# EAGLE design Arm controller (EAGLE 9.2.0)
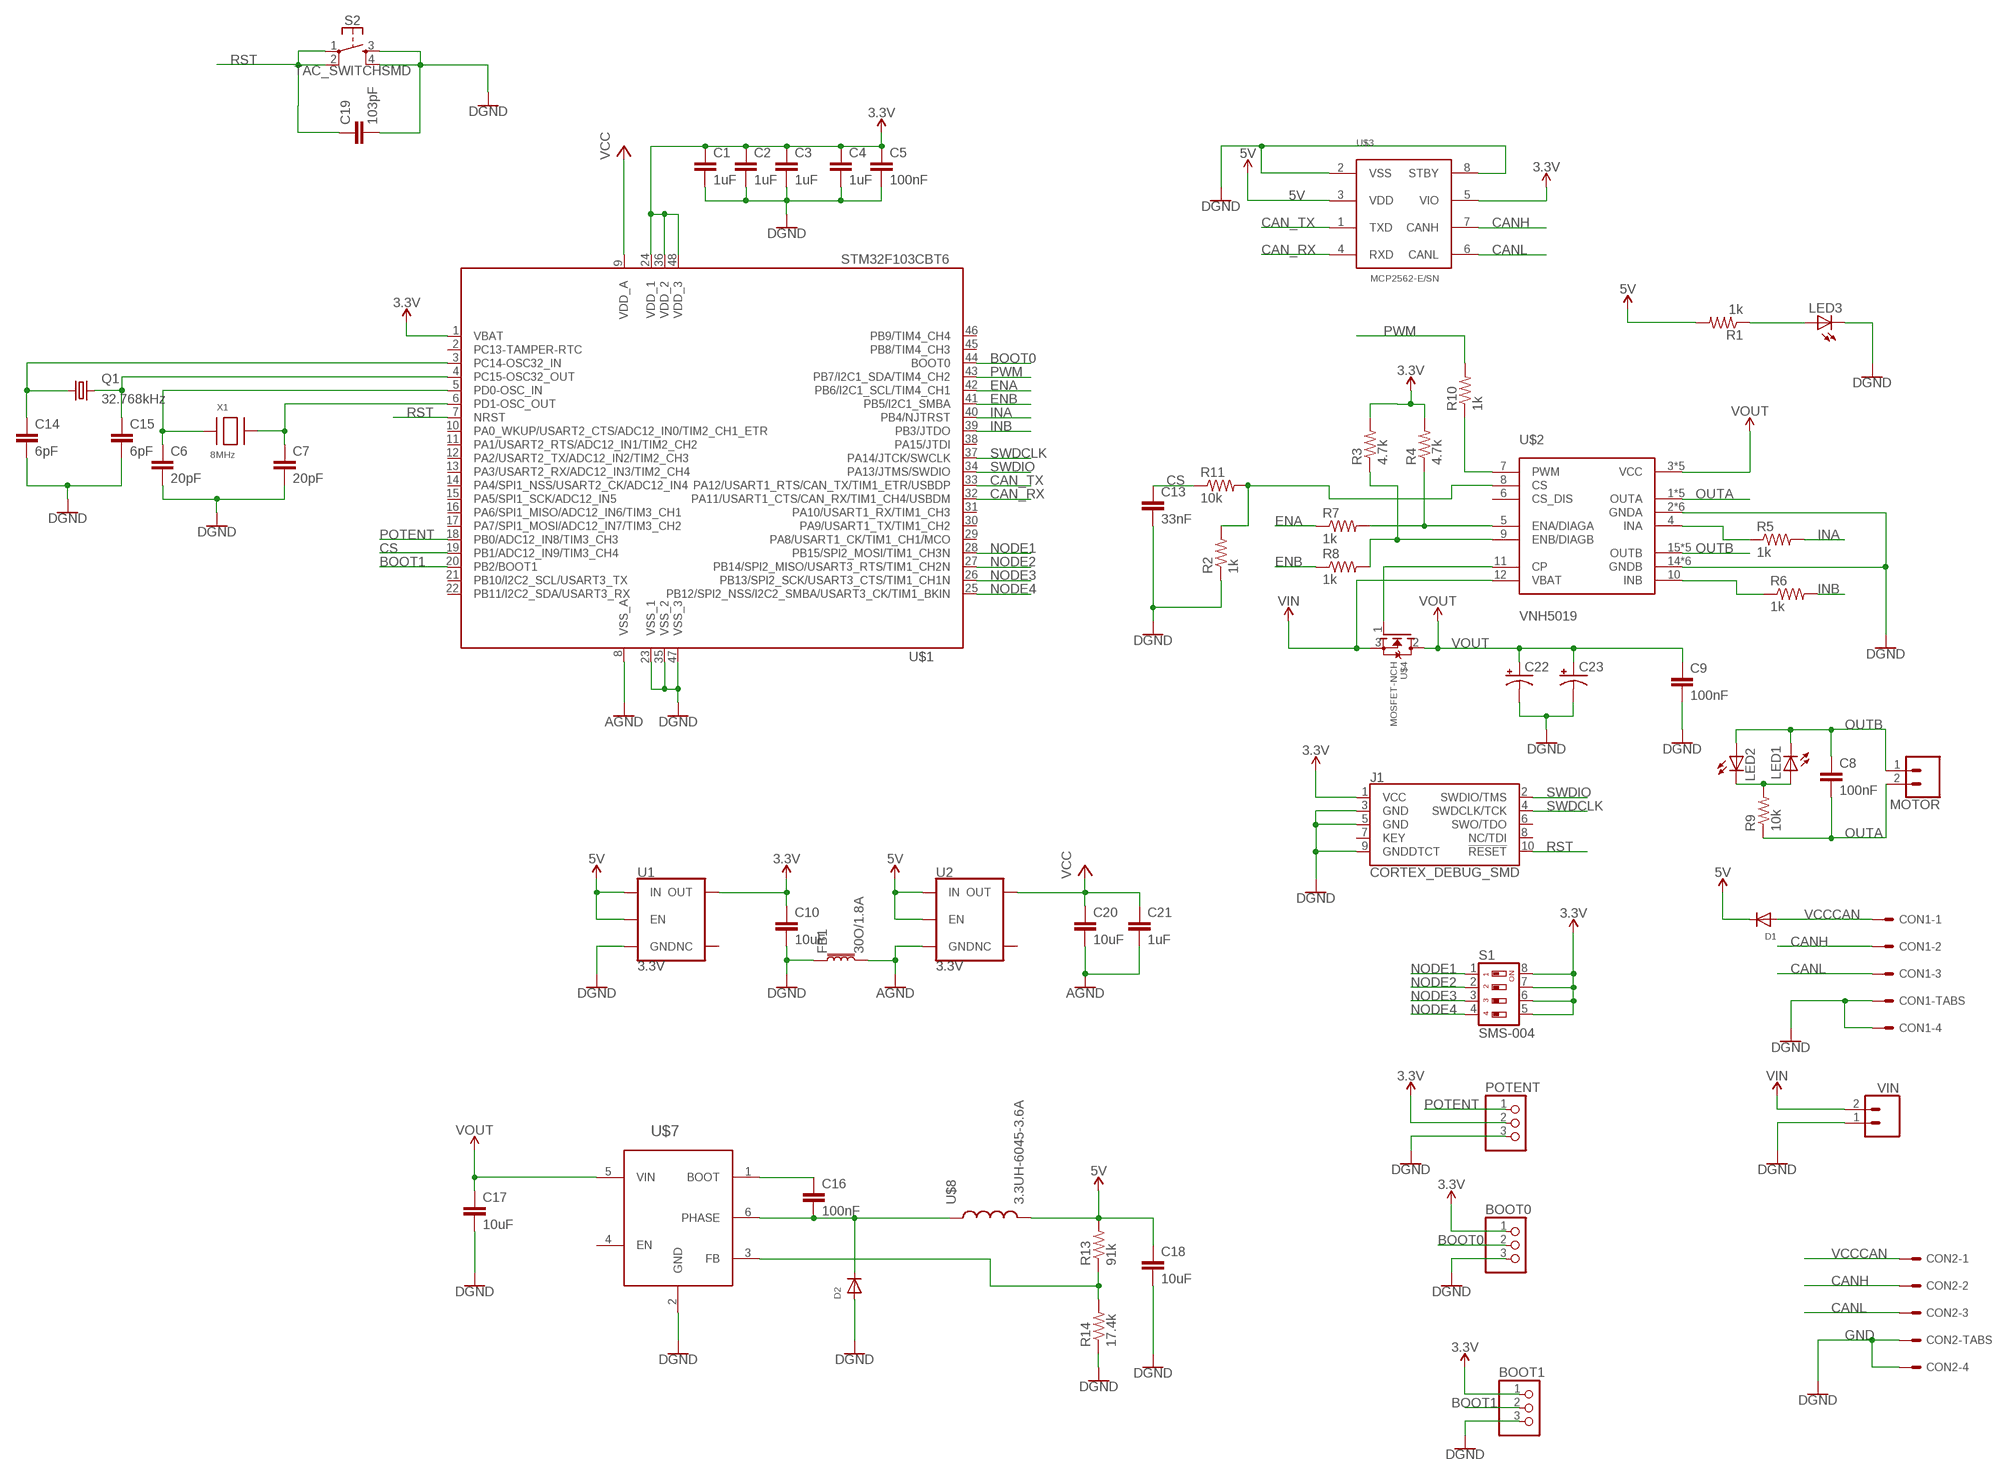
[diagram p0: schematic, sheet 1]

## Parts
BOOT0  PINHD-1X3  [1X03]
BOOT1  PINHD-1X3  [1X03]
C1  1uF  C-EUC0805  [C0805]
C2  1uF  C-EUC0805  [C0805]
C3  1uF  C-EUC0805  [C0805]
C4  1uF  C-EUC0805  [C0805]
C5  100nF  C-EUC0805  [C0805]
C6  20pF  C-EUC0805  [C0805]
C7  20pF  C-EUC0805  [C0805]
C8  100nF  C-EUC1206  [C1206]
C9  100nF  C-EUC0805  [C0805]
C10  10uF  C-EUC1206  [C1206]
C13  33nF  C-EUC0805  [C0805]
C14  6pF  C-EUC0805  [C0805]
C15  6pF  C-EUC0805  [C0805]
C16  100nF  C-EUC0805  [C0805]
C17  10uF  C-EUC1206  [C1206]
C18  10uF  C-EUC1206  [C1206]
C19  103pF  C-EUC0805  [C0805]
C20  10uF  C-EUC1206  [C1206]
C21  1uF  C-EUC0805  [C0805]
C22  CPOL-USCT7343  [CT7343]
C23  CPOL-USCT7343  [CT7343]
CON1  SM04B-GHS-TB  [SM04B-GHS-TB]
CON2  SM04B-GHS-TB  [SM04B-GHS-TB]
D1  DIODESOD-123  [SOD-123]
D2  DIODESOD-123  [SOD-123]
FB1  30O/1.8A  FERRITE_BEAD-0603  [0603]
J1  CORTEX_DEBUG_SMD  [SAMTECH_FTSH-105-01]
LED1  LEDCHIPLED_0805  [CHIPLED_0805]
LED2  LEDCHIPLED_0805  [CHIPLED_0805]
LED3  LEDCHIPLED_0805  [CHIPLED_0805]
MOTOR  CONN_025MM  [SCREWTERMINAL-5MM-2]
POTENT  PINHD-1X3  [1X03]
Q1  32.768kHz  KX-327  [3.2X1.5]
R1  1k  R-US_R0805  [R0805]
R2  1k  R-US_R0805  [R0805]
R3  4.7k  R-US_R0805  [R0805]
R4  4.7k  R-US_R0805  [R0805]
R5  1k  R-US_R0805  [R0805]
R6  1k  R-US_R0805  [R0805]
R7  1k  R-US_R0805  [R0805]
R8  1k  R-US_R0805  [R0805]
R9  10k  R-US_R0805  [R0805]
R10  1k  R-US_R0805  [R0805]
R11  10k  R-US_R0805  [R0805]
R13  91k  R-US_R0805  [R0805]
R14  17.4k  R-US_R0805  [R0805]
S1  SMS-004  [SMS-004]
S2  TAC_SWITCHSMD  MOMENTARY-SWITCH-SPST-2-SMD-5.2MM  [TACTILE_SWITCH_SMD_5.2MM]
U1  3.3V  V_REG_AP2112K-3.3V  [SOT23-5]
U2  3.3V  V_REG_AP2112K-3.3V  [SOT23-5]
U$1  STM32F103CBT6  [STM32_LQFP48]
U$2  VNH5019  [MULTIPOWERSO-30]
U$3  MCP2562-E/SN  [SOIC8]
U$4  MOSFET-NCH  [TO252-3]
U$7  RT6200  [TSOT23-6]
U$8  3.3UH-6045-3.6A  [INDC6161X450]
VIN  CONN_025MM  [SCREWTERMINAL-5MM-2]
X1  8MHz  XTALNX5032  [NX5032]

## Nets
1: R4.1 R7.2 U$2.5(ENA/DIAGA)
2: R3.1 R8.2 U$2.9(ENB/DIAGB)
3.3V: BOOT0.1 BOOT1.1 C1.1 C2.1 C3.1 C4.1 C5.1 C10.1 J1.1(VCC) POTENT.2 R3.2 R4.2 S1.5 S1.6 S1.7 S1.8 U1.5(OUT) U$1.1(VBAT) U$1.24(VDD_1) U$1.36(VDD_2) U$1.48(VDD_3) U$3.5(VIO)
5V: C18.1 D1.C R1.2 R13.2 U1.1(IN) U1.3(EN) U2.1(IN) U2.3(EN) U$3.3(VDD) U$8.2
AGND: C20.2 C21.2 FB1.2 U2.2(GND) U$1.8(VSS_A)
BOOT0: BOOT0.2 U$1.44(BOOT0)
BOOT1: BOOT1.2 U$1.20(PB2/BOOT1)
CAN_RX: U$1.32(PA11/USART1_CTS/CAN_RX/TIM1_CH4/USBDM) U$3.4(RXD)
CAN_TX: U$1.33(PA12/USART1_RTS/CAN_TX/TIM1_ETR/USBDP) U$3.1(TXD)
CANH: CON1.P$2 CON2.P$2 U$3.7(CANH)
CANL: CON1.P$3 CON2.P$3 U$3.6(CANL)
CS: C13.1 R11.1 U$1.19(PB1/ADC12_IN9/TIM3_CH4)
ENA: R7.1 U$1.42(PB6/I2C1_SCL/TIM4_CH1)
ENB: R8.1 U$1.41(PB5/I2C1_SMBA)
GND: BOOT0.3 BOOT1.3 C1.2 C2.2 C3.2 C4.2 C5.2 C6.2 C7.2 C9.2 C10.2 C13.2 C14.2 C15.2 C17.2 C18.2 C19.2 C22.- C23.- CON1.P$4 CON1.P$5 CON1.P$6 CON2.P$4 CON2.P$5 CON2.P$6 D2.A FB1.1 J1.3(GND) J1.5(GND) J1.9(GNDDTCT) LED3.C POTENT.3 R2.1 R14.1 S2.3 S2.4 U1.2(GND) U$1.23(VSS_1) U$1.35(VSS_2) U$1.47(VSS_3) U$2.2(GNDA) U$2.14(GNDB) U$2.17(GNDB) U$2.18(GNDB) U$2.19(GNDB) U$2.20(GNDB) U$2.22(GNDA) U$2.24(GNDB) U$2.26(GNDA) U$2.27(GNDA) U$2.28(GNDA) U$2.29(GNDA) U$3.2(VSS) U$3.8(STBY) U$7.2(GND) VIN.1 ; supply symbol labelled DGND
INA: R5.2 U$1.40(PB4/NJTRST)
INB: R6.2 U$1.39(PB3/JTDO)
N$1: C6.1 U$1.5(PD0-OSC_IN) X1.P$1
N$2: C7.1 U$1.6(PD1-OSC_OUT) X1.P$2
N$3: LED1.A LED2.C R9.2
N$4: C14.1 Q1.1 U$1.3(PC14-OSC32_IN)
N$9: R5.1 U$2.4(INA)
N$10: R2.2 R11.2 U$2.8(CS)
N$12: R6.1 U$2.10(INB)
N$13: C15.1 Q1.2 U$1.4(PC15-OSC32_OUT)
N$14: U$2.11(CP) U$4.1(G)
N$16: C16.2 D2.C U$7.6(PHASE) U$8.1
N$18: R13.1 R14.2 U$7.3(FB)
N$20: R10.1 U$2.7(PWM)
N$21: C16.1 U$7.1(BOOT)
N$22: LED3.A R1.1
NODE1: S1.1 U$1.28(PB15/SPI2_MOSI/TIM1_CH3N)
NODE2: S1.2 U$1.27(PB14/SPI2_MISO/USART3_RTS/TIM1_CH2N)
NODE3: S1.3 U$1.26(PB13/SPI2_SCK/USART3_CTS/TIM1_CH1N)
NODE4: S1.4 U$1.25(PB12/SPI2_NSS/I2C2_SMBA/USART3_CK/TIM1_BKIN)
OUTA: C8.2 MOTOR.2 R9.1 U$2.1(OUTA) U$2.25(OUTA) U$2.30(OUTA) U$2.OUTA U$2.OUTA@1(OUTA)
OUTB: C8.1 LED1.C LED2.A MOTOR.1 U$2.15(OUTB) U$2.16(OUTB) U$2.21(OUTB) U$2.OUTB U$2.OUTB@1(OUTB)
POTENT: POTENT.1 U$1.18(PB0/ADC12_IN8/TIM3_CH3)
PWM: R10.2 U$1.43(PB7/I2C1_SDA/TIM4_CH2)
RST: C19.1 J1.10(!RESET) S2.1 S2.2 U$1.7(NRST)
SWDCLK: J1.4(SWDCLK/TCK) U$1.37(PA14/JTCK/SWCLK)
SWDIO: J1.2(SWDIO/TMS) U$1.34(PA13/JTMS/SWDIO)
VCC: C20.1 C21.1 U2.5(OUT) U$1.9(VDD_A)
VCCCAN: CON1.P$1 CON2.P$1 D1.A
VIN: U$2.12(VBAT) U$4.3(S) VIN.2
VOUT: C9.1 C17.1 C22.+ C23.+ U$2.3(VCC) U$2.13(VCC) U$2.23(VCC) U$2.VCC U$2.VCC@1(VCC) U$4.2(D) U$7.5(VIN)
Unconnected: J1.6(SWO/TDO) J1.7(KEY) J1.8(NC/TDI) U1.4(NC) U2.4(NC) U$1.2(PC13-TAMPER-RTC) U$1.10(PA0_WKUP/USART2_CTS/ADC12_IN0/TIM2_CH1_ETR) U$1.11(PA1/USART2_RTS/ADC12_IN1/TIM2_CH2) U$1.12(PA2/USART2_TX/ADC12_IN2/TIM2_CH3) U$1.13(PA3/USART2_RX/ADC12_IN3/TIM2_CH4) U$1.14(PA4/SPI1_NSS/USART2_CK/ADC12_IN4) U$1.15(PA5/SPI1_SCK/ADC12_IN5) U$1.16(PA6/SPI1_MISO/ADC12_IN6/TIM3_CH1) U$1.17(PA7/SPI1_MOSI/ADC12_IN7/TIM3_CH2) U$1.21(PB10/I2C2_SCL/USART3_TX) U$1.22(PB11/I2C2_SDA/USART3_RX) U$1.29(PA8/USART1_CK/TIM1_CH1/MCO) U$1.30(PA9/USART1_TX/TIM1_CH2) U$1.31(PA10/USART1_RX/TIM1_CH3) U$1.38(PA15/JTDI) U$1.45(PB8/TIM4_CH3) U$1.46(PB9/TIM4_CH4) U$2.6(CS_DIS) U$7.4(EN)

## Library data of the parts
BOOT0 BOOT1 POTENT = pinhead:PINHD-1X3: PIN HEADER
C1-C7 C9 C13-C15 C18 C19 C21 = rcl:C-EU: CAPACITOR, European symbol; SPICEPREFIX: C
C8 C10 C16 C17 C20 = resistor:C-EU: CAPACITOR, European symbol
C22 C23 = rcl:CPOL-US: POLARIZED CAPACITOR, American symbol; SPICEPREFIX: C
CON1 CON2 = SPEAR:SM04B-GHS-TB
D1 D2 = adafruit:DIODE: Diode SMADIODE - SMA Surface Mount Package 20V 1A Schottky Diode Digikey: 641-1014-6-ND DO-1N4148 - Through Hole Small Current Diode SOD-123 20V 1 A (.5mV Vf) Schottky Diode - Digikey: MBRX120TPMSCT-ND SOD-323 10V 570mA (.38mV Vf, 3ns) Schottky Diode - Digikey: ZLLS410CT-ND SOD-523 30V 30mA Schottky Diode (RB751S-40TE61) - Digikey: RB751S-40TE61CT-ND SOT23-R/W - SOT23 Package (R = Solder Paste/Reflow Ovens, W = Hand-Soldering) BAT54Film 40V 300mA - Digikey: 497-7162-1-ND
FB1 = SPEAR:FERRITE_BEAD: Ferrite Bead (blocks, cores, rings, chokes, etc.) Inductor with layers of ferrite used to suppress high frequencies. Often used to isolate high frequency noise. SparkFun Products: IOIO-OTG - V2.2 <https://www.sparkfun.com/products/13613> SparkFun SAMD21 Mini Breakout <https://www.sparkfun.com/products/13664> SparkFun 6 Degrees of Freedom Breakout - LSM6DS3 <https://www.sparkfun.com/products/13339> SparkFun SAMD21 Dev Breakout <https://www.sparkfun.com/products/13672>; PROD_ID: NDUC-13805
J1 = SparkFun-Connectors:CORTEX_DEBUG: Cortex Debug Connector - 10 pin Supports JTAG debug, Serial Wire debug, and Serial Wire Viewer. PTH and SMD connector options available. General Connector Information <http://infocenter.arm.com/help/topic/com.arm.doc.faqs/attached/13634/cortex_debug_connectors.pdf> Products: PTH Connector <http://www.digikey.com/product-detail/en/cnc-tech/3220-10-0100-00/1175-1627-ND/3883661> -via Digi-Key SparkFun PSoc <https://www.sparkfun.com/products/13229> SparkFun T <https://www.sparkfun.com/products/13810>
LED1-LED3 = led:LED: LED OSRAM: - CHIPLED LG R971, LG N971, LY N971, LG Q971, LY Q971, LO R971, LY R971 LH N974, LH R974 LS Q976, LO Q976, LY Q976 LO Q996 - Hyper CHIPLED LW Q18S LB Q993, LB Q99A, LB R99A - SideLED LS A670, LO A670, LY A670, LG A670, LP A670 LB A673, LV A673, LT A673, LW A673 LH A674 LY A675 LS A676, LA A676, LO A676, LY A676, LW A676 LS A679, LY A679, LG A679 - Hyper Micro SIDELED® LS Y876, LA Y876, LO Y876, LY Y876 LT Y87S - SmartLED LW L88C, LW L88S LB L89C, LB L89S, LG L890 LS L89K, LO L89K, LY L89K LS L896, LA L896, LO L896, LY L896 - TOPLED LS T670, LO T670, LY T670, LG T670, LP T670 LSG T670, LSP T670, LSY T670, LOP T670, LYG T670 LG T671, LOG T671, LSG T671 LB T673, LV T673, LT T673, LW T673 LH T674 LS T676, LA T676, LO T676, LY T676, LB T676, LH T676, LSB T676, LW T676 LB T67C, LV T67C, LT T67C, LS T67K, LO T67K, LY T67K, LW E67C LS E67B, LA E67B, LO E67B, LY E67B, LB E67C, LV E67C, LT E67C LW T67C LS T679, LY T679, LG T679 LS T770, LO T770, LY T770, LG T770, LP T770 LB T773, LV T773, LT T773, LW T773 LH T774 LS E675, LA E675, LY E675, LS T675 LS T776, LA T776, LO T776, LY T776, LB T776 LHGB T686 LT T68C, LB T68C - Hyper Mini TOPLED® LB M676 - Mini TOPLED Santana® LG M470 LS M47K, LO M47K, LY M47K Source: http://www.osram.convergy.de LUXEON: - LUMILED® LXK2-PW12-R00, LXK2-PW12-S00, LXK2-PW14-U00, LXK2-PW14-V00 LXK2-PM12-R00, LXK2-PM12-S00, LXK2-PM14-U00 LXK2-PE12-Q00, LXK2-PE12-R00, LXK2-PE12-S00, LXK2-PE14-T00, LXK2-PE14-U00 LXK2-PB12-K00, LXK2-PB12-L00, LXK2-PB12-M00, LXK2-PB14-N00, LXK2-PB14-P00, LXK2-PB14-Q00 LXK2-PR12-L00, LXK2-PR12-M00, LXK2-PR14-Q00, LXK2-PR14-R00 LXK2-PD12-Q00, LXK2-PD12-R00, LXK2-PD12-S00 LXK2-PH12-R00, LXK2-PH12-S00 LXK2-PL12-P00, LXK2-PL12-Q00, LXK2-PL12-R00 Source: www.luxeon.com KINGBRIGHT: KA-3528ASYC Source: www.kingbright.com
MOTOR VIN = SparkFun-Connectors:CONN_02: Multi connection point. Often used as Generic Header-pin footprint for 0.1 inch spaced/style header connections On any of the 0.1 inch spaced packages, you can populate with these: Break Away Headers - Straight <https://www.sparkfun.com/products/116> (PRT-00116) Break Away Male Headers - Right Angle <https://www.sparkfun.com/products/553> (PRT-00553) Female Headers <https://www.sparkfun.com/products/115> (PRT-00115) Break Away Headers - Machine Pin <https://www.sparkfun.com/products/117> (PRT-00117) Break Away Female Headers - Swiss Machine Pin <https://www.sparkfun.com/products/743> (PRT-00743) For SCREWTERMINALS and SPRING TERMINALS visit here: Screw Terimnals on SparkFun.com <https://www.sparkfun.com/search/results?term=Screw+Terminals> (5mm/3.5mm/2.54mm spacing) This device is also useful as a general connection point to wire up your design to another part of your project. Our various solder wires solder well into these plated through hole pads. Hook-Up Wire - Assortment (Stranded, 22 AWG) <https://www.sparkfun.com/products/11375> (PRT-11375) Hook-Up Wire - Assortment (Solid Core, 22 AWG) <https://www.sparkfun.com/products/11367> (PRT-11367) View the entire wire category on our website here <https://www.sparkfun.com/categories/141> Special notes: Molex polarized connector foot print use with: PRT-08233 with associated crimp pins and housings. 2.54_SCREWTERM for use with PRT-10571. 3.5mm Screw Terminal footprints for PRT-08084 5mm Screw Terminal footprints for use with PRT-08432; SF_SKU: PRT-08432
Q1 = SPEAR:KX-327
R1-R11 R13 R14 = rcl:R-US_: RESISTOR, American symbol; SPICEPREFIX: R
S1 = SPEAR:SMS-004
S2 = SPEAR:MOMENTARY-SWITCH-SPST-2: Momentary Switch (Pushbutton) - SPST - Two Circuits Normally-open (NO) SPST momentary switches (buttons, pushbuttons). Schematic symbol includes two switch circuits. Variants SMD-4.6MMX2.8MM - 4.60mm x 2.80mm Tactile Momentary Button Switch - Used on SparkFun SAMD21 Mini Breakout <https://www.sparkfun.com/products/13664> SMD-5.2MM - Mini Pushbutton Switch - SMD <https://www.sparkfun.com/products/8720> - Used on Arduino Pro Mini <https://www.sparkfun.com/products/11114>; PROD_ID: SWCH-08247; SF_SKU: COM-08720
U1 U2 = SparkFun-IC-Power:V_REG_AP2112: AP2112 - 600mA CMOS LDO Regulator w/ Enable The AP2112 is CMOS process low dropout linear regulator with enable function, the regulator delivers a guaranteed 600mA (min.) continuous load current. Features Output Voltage Accuracy: ±1.5% Output Current: 600mA (Min.) Foldback Short Current Protection: 50mA Enable Function to Turn ON/OFF VOUT Low Dropout Voltage (3.3V): 250mV (Typ.) @IOUT=600mA Excellent Load Regulation: 0.2%/A (Typ.) Excellent Line Regulation: 0.02%/V (Typ.) Low Quiescent Current: 55μA (Typ.) Low Standby Current: 0.01μA (Typ.) Low Output Noise: 50μVRMS PSRR: 100Hz -65dB, 1kHz -65dB OTSD Protection Stable with 1.0μF Flexible Cap: Ceramic, Tantalum and Aluminum Electrolytic Operation Temperature Range: -40°C to 85°C ESD: MM 400V, HBM 4000V; PROD_ID: VREG-12457
U$1 = SPEAR:STM32F103CBT6
U$2 = SPEAR:VNH5019: The VHN5019A-E is a full bridge motor driver intended for a wide range of automotive applications. The device incorporates a dual monolithic high-side drivers and two low-side switches. The high-side driver switch is designed using STMicroelectronics’ well known and proven proprietary VIPower® M0 technology that allows to efficiently integrate on the same die a true Power MOSFET with an intelligent signal/protection circuit.
U$3 = SPEAR:MCP2562-E/SN
U$4 = SPEAR:MOSFET-NCH: N-Channel MOSFET like the IPB80N03S4L-03.
U$7 = SPEAR:RT6200
U$8 = LCSC:3.3UH-6045-3.6A
X1 = adafruit:XTAL: Low cost SMT crystals, no capacitors included http://www.ladyada.net/library/eagle

## Board
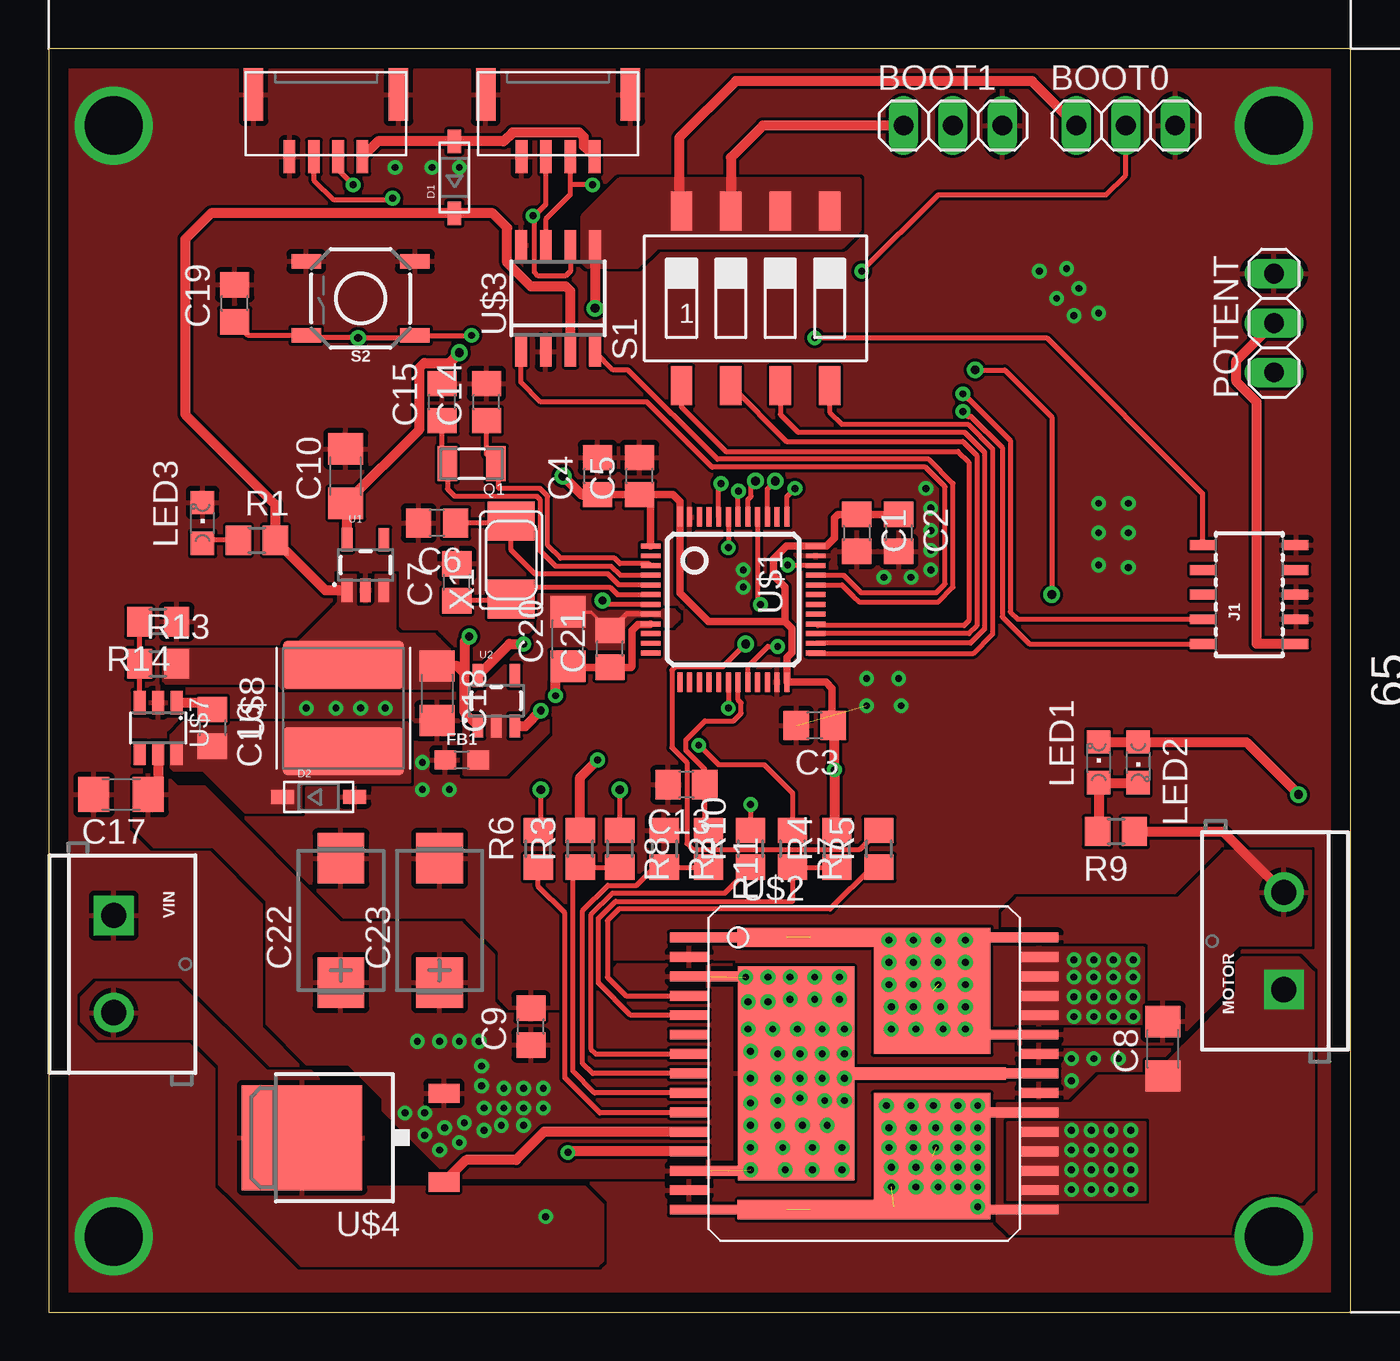
[diagram p1: board, top side]
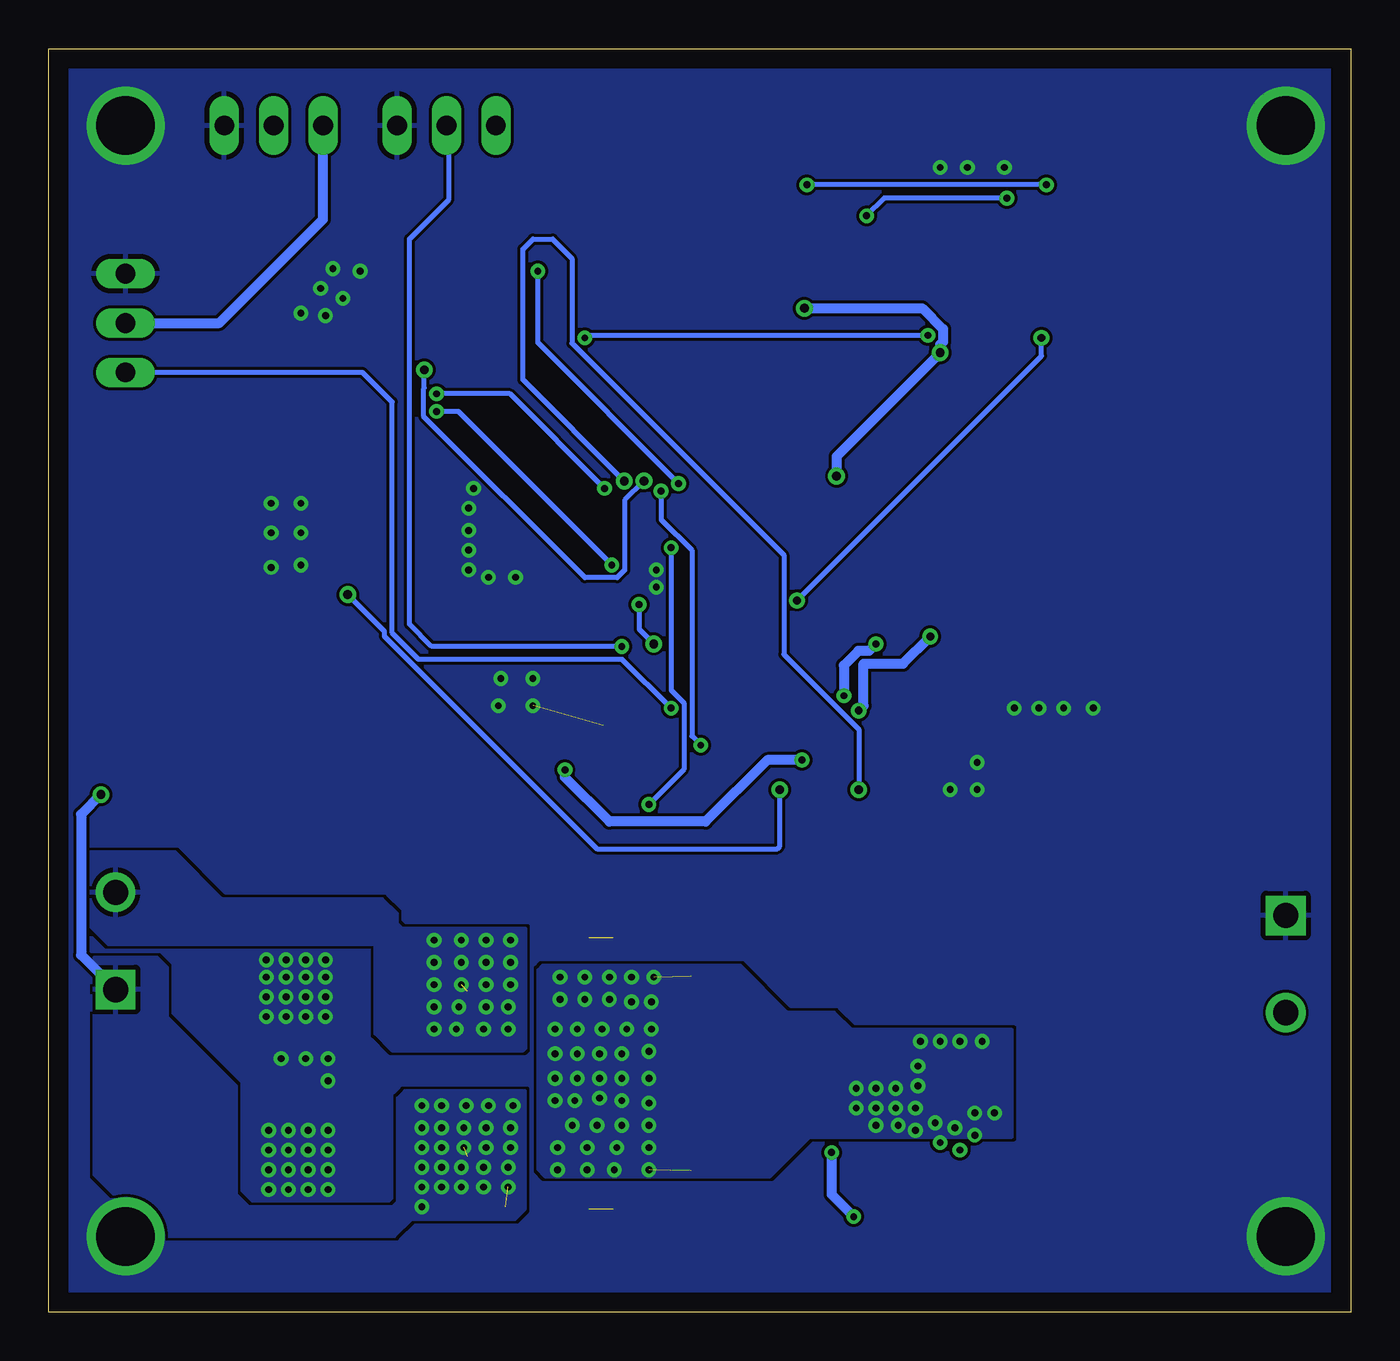
[diagram p2: board, bottom side, seen from below]

Size 67 x 65 mm. Coordinates in mm from the lower left corner, seen from the top.
Outline: 0,0 67,0 67,65 0,65 0,0
Copper layers (1*16): Top 0.035mm / dielectric 1.5mm / Bottom 0.035mm
Design rules "default *": minimum track width 6mil, minimum drill 0.35mm, track to track 6mil, track to pad 6mil, pad to pad 6mil, via to via 6mil, smd to smd 6mil, copper to edge 40mil, drill to drill 6mil, minimum pad ring 10mil, minimum via ring 8mil, stop-mask expansion 4mil, vias tented up to drill 15mil, thermal gap 10mil

### Footprints (pad centres in the part's own frame; a part is rotated, then mirrored left to right if it is on the bottom)
1X03 = drill 1.016 long: 1 -2.54,0; 2 0,0; 3 2.54,0
C0805 = smd 1.3 x 1.5: 1 -0.95,0; 2 0.95,0
C1206 = smd 1.6 x 1.8: 1 -1.4,0; 2 1.4,0
CT7343 = smd 2.6 x 2.4: + -3.2,0; - 3.2,0
SM04B-GHS-TB = smd 0.6 x 1.7: P$1 -1.875,0.85; P$2 -0.625,0.85; P$3 0.625,0.85; P$4 1.875,0.85 | smd 1 x 2.7: P$5 -3.725,-2.35; P$6 3.725,-2.35
SOD-123 = smd 1.2 x 0.7: A 1.85,0; C -1.85,0
0603 = smd 1.1 x 1: 1 -0.85,0; 2 0.85,0
SAMTECH_FTSH-105-01 = smd 0.508 x 1.27: 1 -2.54,-2.413; 2 -2.54,2.413; 3 -1.27,-2.413; 4 -1.27,2.413; 5 0,-2.413; 6 0,2.413; 7 1.27,-2.413; 8 1.27,2.413; 9 2.54,-2.413; 10 2.54,2.413
CHIPLED_0805 = smd 1.2 x 1.2: A 0,-1.05; C 0,1.05
SCREWTERMINAL-5MM-2 = drill 1.3 pad 2.032 square: 1 0,0 | drill 1.3 pad 2.032: 2 5,0
3.2X1.5 = smd 1 x 1.8: 1 -1.25,0; 2 1.25,0
R0805 = smd 1.3 x 1.5: 1 -0.95,0; 2 0.95,0
SMS-004 = smd 1.092 x 2.007: 1 -3.81,-4.496; 2 -1.27,-4.496; 3 1.27,-4.496; 4 3.81,-4.496; 5 3.81,4.496; 6 1.27,4.496; 7 -1.27,4.496; 8 -3.81,4.496
TACTILE_SWITCH_SMD_5.2MM = smd 1.524 x 0.762: 1 -2.794,1.905; 2 2.794,1.905; 3 -2.794,-1.905; 4 2.794,-1.905
SOT23-5 = smd 0.55 x 1.2: 1 -0.95,-1.3; 2 0,-1.3; 3 0.95,-1.3; 4 0.95,1.3; 5 -0.95,1.3
STM32_LQFP48 = smd 0.254 x 1: 1 -2.75,-4.25; 2 -2.25,-4.25; 3 -1.75,-4.25; 4 -1.25,-4.25; 5 -0.75,-4.25; 6 -0.25,-4.25; 7 0.25,-4.25; 8 0.75,-4.25; 9 1.25,-4.25; 10 1.75,-4.25; 11 2.25,-4.25; 12 2.75,-4.25; 25 2.75,4.25; 26 2.25,4.25; 27 1.75,4.25; 28 1.25,4.25; 29 0.75,4.25; 30 0.25,4.25; 31 -0.25,4.25; 32 -0.75,4.25; 33 -1.25,4.25; 34 -1.75,4.25; 35 -2.25,4.25; 36 -2.75,4.25 | smd 1 x 0.254: 13 4.25,-2.75; 14 4.25,-2.25; 15 4.25,-1.75; 16 4.25,-1.25; 17 4.25,-0.75; 18 4.25,-0.25; 19 4.25,0.25; 20 4.25,0.75; 21 4.25,1.25; 22 4.25,1.75; 23 4.25,2.25; 24 4.25,2.75; 37 -4.25,2.75; 38 -4.25,2.25; 39 -4.25,1.75; 40 -4.25,1.25; 41 -4.25,0.75; 42 -4.25,0.25; 43 -4.25,-0.25; 44 -4.25,-0.75; 45 -4.25,-1.25; 46 -4.25,-1.75; 47 -4.25,-2.25; 48 -4.25,-2.75
MULTIPOWERSO-30 = smd 0.508 x 12: 1 -7,-4; 15 7,-4; 16 7,4; 30 -7,4 | smd 0.508 x 2: 2 -6,-9; 4 -4,-9; 5 -3,-9; 6 -2,-9; 7 -1,-9; 8 0,-9; 9 1,-9; 10 2,-9; 11 3,-9; 12 4,-9; 14 6,-9; 17 6,9; 18 5,9; 19 4,9; 20 3,9; 22 1,9; 24 -1,9; 26 -3,9; 27 -4,9; 28 -5,9; 29 -6,9 | smd 0.508 x 4: 3 -5,-8; 13 5,-8; 21 2,8; 23 0,8; 25 -2,8 | smd 6.5 x 6: OUTA -4.25,3.5; OUTB 4.25,3.5 | smd 1 x 7.5: OUTA@1 -7,-2.755; OUTB@1 7,-2.755 | smd 11 x 6: VCC 0,-3.5 | smd 0.65 x 8.3: VCC@1 0,3.145
SOIC8 = smd 0.6 x 1.5: 1 -1.905,-2.75; 2 -0.635,-2.75; 3 0.635,-2.75; 4 1.905,-2.75; 5 1.905,2.75; 6 0.635,2.75; 7 -0.635,2.75; 8 -1.905,2.75
TO252-3 = smd 1 x 1.6: 1 -2.28,-6.07; 2 2.28,-6.07 | smd 5.4 x 6.2: 3 0,1.23
TSOT23-6 = smd 0.62 x 1.22: 1 -0.95,-1.3; 2 0,-1.3; 3 0.95,-1.3; 4 0.95,1.3; 5 0,1.3; 6 -0.95,1.3
INDC6161X450 = smd 2.479 x 6.229: 1 -2.225,0; 2 2.225,0
NX5032 = smd 2 x 2.4: P$1 2,0; P$2 -2,0

### Placement (x,y rotation side)
BOOT0  55.42,61.04 0 top
BOOT1  46.53,61.04 0 top
C1  41.58,40.09 270 top
C2  43.74,40.09 270 top
C3  39.42,30.18 180 top
C4  28.24,43.01 90 top
C5  30.4,43.01 90 top
C6  19.99,40.59 180 top
C7  21,37.55 90 top
C8  57.33,13.54 90 top
C9  24.81,14.68 90 top
C10  15.29,43.01 90 top
C13  32.81,27.13 180 top
C14  22.53,46.82 90 top
C15  20.24,46.82 90 top
C16  8.43,30.05 270 top
C17  3.73,26.62 180 top
C18  19.99,31.83 270 top
C19  9.57,51.9 90 top
C20  26.72,34.62 90 top
C21  28.88,34.12 90 top
C22  15.03,20.15 90 top
C23  20.11,20.15 90 top
CON1  26.21,60.28 180 top
CON2  14.27,60.28 180 top
D1  20.88,58.37 90 top
D2  13.89,26.5 0 top
FB1  21.26,28.4 0 top
J1  61.77,36.91 90 top
LED1  54.02,28.27 0 top
LED2  56.05,28.27 180 top
LED3  7.92,40.59 0 top
MOTOR  63.55,16.59 90 top
POTENT  63.04,50.88 90 top
Q1  21.77,43.64 180 top
R1  10.72,39.7 0 top
R2  31.67,23.83 270 top
R3  27.35,23.83 90 top
R4  40.56,23.83 90 top
R5  42.72,23.83 90 top
R6  25.19,23.83 90 top
R7  38.27,23.83 270 top
R8  29.38,23.83 270 top
R9  54.91,24.72 180 top
R10  36.12,23.83 90 top
R11  33.96,23.83 270 top
R13  5.64,33.35 0 top
R14  5.64,35.51 180 top
S1  36.37,52.15 0 top
S2  16.05,52.15 180 top
U1  16.3,38.43 0 top
U2  23.04,31.45 0 top
U$1  35.23,36.66 270 top
U$2  41.96,12.27 270 top
U$3  26.21,52.15 0 top
U$4  14.27,8.97 90 top
U$7  5.64,30.05 180 top
U$8  15.16,31.07 90 top
VIN  3.35,20.4 270 top
X1  23.8,38.69 90 top

### Tracks (layer width: path | path; a pad name or v marks a point on that pad's centre or on a via)
1
  Top 0.254: U$2.5 29.94,15.27 28.29,16.92 28.29,20.26 29.17,21.14 38.27,21.14 R7.2 R4.1
2
  Top 0.254: U$2.9 28.1,11.27 26.97,12.4 26.97,22.5 R3.1 R8.2
3.3V  (via drill 0.35, 0.45)
  Top 0.381: C2.1 C1.1 40.62,41.03 40.43,40.85 40.43,39.83 40.01,39.41 U$1.36 37.97,39.41 37.3,38.73 37.3,37.97 37.26,37.93 37.89,37.29 37.89,35.51 | 30.53,42.06 C5.1 C4.1 | 30.53,42.06 32.11,42.06 32.48,41.69 U$1.48 32.48,36.99 33.96,35.51 37.89,35.51 | U$1.1 30.98,41.61 30.53,42.06 | 37.89,35.51 38.23,35.17 38.23,33.94 37.98,33.68 U$1.24 39.98,32.41 40.31,32.08 40.31,30.24 C3.1
  Top 0.508: U1.5 15.35,41.54 C10.1 19.09,45.4 19.09,48.58 19.32,48.82 20.6,48.82 v21.13,49.36 | BOOT1.1 36.75,61.04 35.1,59.39 S1.7 | BOOT0.1 50.59,63.33 35.35,63.33 32.43,60.41 32.43,56.77 S1.8 | J1.1 62.15,34.37 62.15,46.81 61.11,47.86 61.11,48.95 POTENT.2 | v26.46,43.01 27.41,42.06 C4.1 | U$3.5 v28.11,51.64 | R3.2 27.35,27.51 v28.24,28.4 | R4.2 40.43,24.91 v40.43,27.89 40.43,30.11 C3.1
  Bottom 0.508: POTENT.2 58.21,50.88 52.88,56.21 BOOT0.1 | v26.46,43.01 26.46,44.02 v21.13,49.36 21.13,49.77 20.98,49.92 20.98,50.57 22.05,51.64 v28.11,51.64 | v28.24,28.4 30.02,28.4 33.2,25.23 38.15,25.23 40.43,27.51 v40.43,27.89
  pour Top (no thermals): 27.48,56.34 27.48,54.05 27.73,53.8 30.27,53.8 31.29,54.82 40.81,54.82 41.7,55.71 41.7,58.25 29.38,58.25
5V  (via drill 0.4)
  Top 0.508: U2.1 21.4,30.83 21.4,32.85 | 21.4,32.85 21.02,33.23 C18.1 | U2.3 24.53,30.15 v25.32,30.94 | v21.64,34.75 21.4,34.52 21.4,32.85 | U$3.3 26.84,52.53 26.62,52.76 24.82,52.76 23.6,53.98 23.6,55.78 22.85,56.52 D1.C 8.36,56.52 7.16,55.33 7.03,55.2 7.03,46.18 11.67,41.55 R1.2 14.24,37.13 U1.1
  Bottom 0.508: v25.32,30.94 25.07,31.2 25.07,33.35 23.04,33.35 v21.64,34.75
  pour Top (no thermals): 5.89,34.12 5.89,32.47 6.02,32.34 11.73,32.34 11.99,32.08 20.62,32.08 20.62,34.12 20.11,34.62 19.86,34.88 18.08,34.88 17.83,35.13 17.83,37.93 16.81,37.93 16.81,36.53 16.56,36.27 15.92,36.27 15.8,36.4 15.8,37.67 15.8,37.93 14.91,37.93 14.91,36.53 14.65,36.27 12.49,34.12
AGND
  Top 0.152: C20.2 27.92,36.02 C21.2
  Top 0.254: U$1.8 29.72,35.91 C21.2
  pour Top (no thermals): 25.19,36.91 27.99,36.91 28.75,36.15 32.05,36.15 32.18,36.15 32.43,35.89 32.43,35.64 32.31,35.51 32.05,35.26 30.15,35.26 29.89,35.01 29.89,34.12 25.96,34.12 25.7,33.86 25.7,32.08 25.7,29.8 23.54,27.64 21.38,27.64 21.38,31.2 24.3,34.12 25.19,35.01
BOOT0  (via drill 0.35)
  Top 0.254: U$1.44 34.48,42.51 v34.59,42.62 | v41.83,53.55 45.77,57.48 54.4,57.48 55.42,58.5 BOOT0.2
  Bottom 0.254: v34.59,42.62 41.83,49.86 v41.83,53.55
BOOT1  (via drill 0.35)
  Top 0.254: U$1.20 35.98,33.22 37,34.24 v37.51,34.24
  Bottom 0.254: BOOT1.2 46.4,60.91 46.4,57.23 48.44,55.2 48.44,35.39 47.29,34.24 v37.51,34.24
CAN_RX
  Top 0.254: U$1.32 40.83,37.41 41.39,36.85 41.7,36.53 45.77,36.53 46.53,37.29 46.53,42.62 45.28,43.87 34.4,43.87 29.8,48.47 29.05,48.47 U$3.4
CAN_TX
  Top 0.254: U$1.33 40.9,37.91 41.8,37.01 45.67,37.01 46.12,37.46 46.12,42.46 45.12,43.46 34.13,43.46 30.78,46.82 25.32,46.82 24.3,47.83 U$3.1
CANH  (via drill 0.35)
  Top 0.254: CON1.P$2 26.84,57.99 | 26.84,57.99 26.84,57.47 25.57,56.21 U$3.7 | CON2.P$2 14.9,58.76 v15.67,57.99 | v27.99,57.99 26.84,57.99
  Bottom 0.254: v15.67,57.99 v27.99,57.99
CANL  (via drill 0.35)
  Top 0.254: U$3.6 26.84,53.55 26.59,53.29 25.19,53.29 25,53.49 25,56.4 | CON1.P$3 25.59,56.99 25,56.4 | CON2.P$3 13.65,58.24 14.65,57.23 17.62,57.23 v17.7,57.31 | v24.92,56.4 25,56.4
  Bottom 0.254: v17.7,57.31 24.01,57.31 v24.92,56.4
CS
  Top 0.254: R11.1 33.76,24.97 C13.1 33.76,27.92 32.79,28.89 32.79,29.44 33.77,30.41 35.24,30.41 35.63,30.8 35.63,31.34 35.48,31.49 U$1.19
ENA  (via drill 0.35)
  Top 0.254: U$1.42 35.48,42.23 v35.49,42.24 | v33.45,29.16 34.45,28.16 36.82,28.16 38.27,26.7 R7.1
  Bottom 0.254: v35.49,42.24 35.48,42.23 35.48,40.76 33.91,39.19 33.91,29.62 v33.45,29.16
ENB  (via drill 0.45)
  Top 0.254: U$1.41 35.98,41.8 36.15,41.96 36.15,42.53 v36.37,42.76 | v47.67,48.47 49.2,48.47 51.61,46.05 v51.61,36.91 | v29.38,26.88 R8.1
  Bottom 0.254: v47.67,48.47 47.67,47.53 47.7,47.51 47.7,46.06 39.41,37.78 37.75,37.78 37.36,38.16 37.36,41.76 v36.37,42.76 | v51.61,36.91 49.73,35.03 49.73,34.77 38.79,23.83 29.51,23.83 29.38,23.96 v29.38,26.88
GND  (via drill 0.35, 3)  (1 unrouted)
  other vias: 52.75,17.23 53.77,17.23 52.75,16.21 53.77,16.21 52.75,15.19 53.77,15.19 52.63,9.35 53.64,9.35 54.66,9.35 55.67,9.35 52.63,8.34 53.64,8.34 54.66,8.34 55.67,8.34 52.63,7.32 53.64,7.32 54.66,7.32 55.67,7.32 3.35,61.04 63.04,61.04 63.04,3.89 3.35,3.89 52.75,18.11 53.77,18.11 54.78,18.11 55.8,18.11 54.78,17.23 55.8,17.23 55.8,16.21 54.78,16.21 54.78,15.19 55.8,15.19 52.63,6.3 53.64,6.3 54.66,6.3 55.67,6.3 45.39,41.35 45.39,39.2 42.09,32.59 43.74,32.59 43.86,31.2 42.09,31.2 54.02,41.61 54.02,38.43 55.55,41.61 54.02,40.09 55.55,40.09 55.55,38.31 13.26,31.07 14.78,31.07 16.05,31.07 17.32,31.07 19.23,28.27 19.23,26.88 20.62,26.88 50.98,53.55 52.37,53.67 53.01,52.66 51.86,52.15 52.75,51.26 54.02,51.39 35.73,37.29 35.73,38.18 52.63,13.03 53.77,13.03 55.04,13.03 52.63,11.89 17.83,58.88 19.73,58.88 21.13,58.88 45.39,40.21 45.39,38.18 44.37,37.8 42.97,37.8 45.13,42.37
  pour Top (rank 4): -3,64.98 -3,-5 -2.87,-5.13 66.98,-5.13 67.1,-5.25 67.1,64.85 66.98,64.98
  pour Bottom (rank 5): -3.38,65.23 -3.38,-5.51 67.36,-5.51 67.48,-5.63 67.48,65.23
  pour Top (no thermals): 49.45,18.75 56.31,18.75 56.31,14.81 49.45,14.81
  pour Top (no thermals): 49.32,9.73 49.32,5.79 56.44,5.79 56.44,9.73
INA  (via drill 0.35, 0.45)
  Top 0.254: U$1.40 36.48,36.55 v36.62,36.4 | v35.86,34.37 34.68,33.19 32.23,33.19 32.07,33.02 32.07,29.04 32.84,28.27 32.84,24.11 33.13,23.81 41.75,23.81 R5.2
  Bottom 0.254: v36.62,36.4 36.62,35.13 v35.86,34.37
INB  (via drill 0.45)
  Top 0.254: U$1.39 36.98,42.34 v37.39,42.75 | v25.32,26.88 25.32,24.91 R6.2
  Bottom 0.254: v37.39,42.75 42.59,47.96 42.59,54.69 42.09,55.2 41.07,55.2 40.08,54.2 40.08,49.85 29.18,38.95 29.18,33.83 25.32,29.98 v25.32,26.88
N$1
  Top 0.254: U$1.5 29.34,37.41 28.77,37.97 25.03,37.97 23.8,39.2 X1.P$1 23.7,40.59 C6.1
N$2
  Top 0.254: U$1.6 29.26,36.91 28.88,37.29 24.4,37.29 X1.P$2 23.7,36.59 C7.1
N$3
  Top 0.508: R9.2 54.02,24.78 LED1.A LED2.C
N$4
  Top 0.254: C14.1 22.53,44.13 Q1.1 23.16,43.49 23.16,42.37 25.28,42.37 25.68,41.97 25.68,39.43 26.34,38.78 29.11,38.78 29.39,38.5 30.88,38.5 U$1.3
N$9
  Top 0.254: R5.1 42.36,22.88 40.21,20.73 29.34,20.73 28.75,20.14 28.75,17.22 29.7,16.27 U$2.4
N$10
  Top 0.254: U$2.8 27.99,12.27 27.48,12.78 27.48,20.65 28.78,21.95 30.25,21.95 31.18,22.88 R2.2 R11.2
N$12
  Top 0.254: U$2.10 32.93,10.24 28.37,10.24 26.57,12.04 26.57,20.53 25.19,21.9 R6.1
N$13
  Top 0.254: C15.1 20.24,43.91 Q1.2 20.52,42.35 20.9,41.97 25.11,41.97 25.28,41.8 25.28,39.18 26.08,38.37 28.94,38.37 29.41,37.91 U$1.4
N$14
  Top 0.508: U$2.11 25.5,9.27 24.05,7.83 21.48,7.83 U$4.1
N$16
  pour Top (no thermals): 13,25.73 13,27.13 13.13,27.26 18.59,27.26 18.59,30.05 18.59,30.18 18.46,30.31 6.91,30.31 6.27,29.67 6.27,28.02 6.4,27.89 7.92,27.89 10.08,25.73
N$18
  Top 0.254: U$7.3 R13.1 R14.2
N$20
  Top 0.254: R10.1 34.78,21.54 29,21.54 27.89,20.43 27.89,13.54 28.16,13.27 U$2.7
N$21
  Top 0.152: 8.4,31.03 C16.1
  Top 0.508: U$7.1 8.08,31.35 8.4,31.03
N$22
  Top 0.254: R1.1 8.08,39.7 LED3.A
NODE1
  Top 0.254: S1.1 32.56,46.56 34.85,44.28 46.78,44.28 47.34,43.72 47.34,35.56 47.09,35.31 39.57,35.31 U$1.28
NODE2
  Top 0.254: S1.2 37.97,44.78 47.03,44.78 47.75,44.07 47.75,35.3 47.35,34.91 U$1.27
NODE3
  Top 0.254: S1.3 37.64,46.18 38.55,45.27 47.12,45.27 48.16,44.23 48.16,35.13 47.43,34.41 U$1.26
NODE4
  Top 0.254: S1.4 40.18,46.31 40.81,45.67 47.29,45.67 48.56,44.4 48.56,34.88 47.55,33.86 39.14,33.86 39.18,33.91 U$1.25
OUTA  (via drill 0.35)  (2 unrouted)
  Top 0.381: v43.23,19.13 43.09,19.27 U$2.1 32.96,19.27 32.94,19.26 44.37,19.26 v44.5,19.13
  Top 0.508: R9.1 60.42,24.72 MOTOR.2
  other vias: 45.77,19.13 47.16,19.13 47.16,17.99 45.77,17.99 44.5,17.99 43.23,17.99 43.23,16.84 44.5,16.84 45.77,16.84 47.16,16.84 47.16,15.7 45.9,15.7 44.5,15.7 43.35,15.7 43.35,14.56 44.62,14.56 46.02,14.56 47.16,14.56
  pour Top (rank 2): 49.07,13.8 57.83,13.8 60.5,16.46 60.5,18.11 61.26,18.88 64.94,18.88 64.94,23.7 60.5,23.7 58.09,21.29 49.83,21.29 49.07,20.53
  pour Bottom (rank 3): 42.47,19.77 42.47,13.54 42.59,13.41 49.32,13.41 50.21,14.3 50.21,18.88 63.93,18.88 64.94,19.89 64.94,23.7 60.5,23.7 58.09,21.29 49.83,21.29 49.07,20.53 49.07,20.02 48.82,19.77
OUTB  (via drill 0.35, 0.45)  (3 unrouted)
  Top 0.254: U$2.OUTB@1 43.34,5.27 43.48,5.41
  Top 0.508: LED1.C LED2.A 61.61,29.32 v64.31,26.62
  Bottom 0.508: v64.31,26.62 65.33,25.61 65.33,18.37 MOTOR.1
  other vias: 43.1,10.62 44.37,10.62 45.51,10.62 46.78,10.62 47.8,10.62 47.8,9.48 46.78,9.48 45.64,9.48 44.5,9.48 43.23,9.48 43.23,8.46 44.5,8.46 45.64,8.46 46.78,8.46 47.8,8.46 47.8,7.45 46.78,7.45 45.77,7.45 44.62,7.45 43.35,7.45 43.35,6.43 44.62,6.43 45.77,6.43 46.78,6.43 47.8,6.43 47.8,5.41
  pour Top (rank 2, no thermals): 48.82,10.75 52.63,10.75 54.02,12.14 56.82,12.14 58.34,13.67 61.14,16.46 61.14,17.99 61.39,18.24 64.31,18.24 65.07,17.48 65.07,14.43 65.07,6.3 63.93,5.16 62.79,4.02 49.45,4.02 48.82,4.65
  pour Bottom (rank 3): 42.47,11.38 48.69,11.38 49.07,11 49.07,5.67 49.32,5.41 56.69,5.41 57.33,6.05 57.33,11.64 60.88,15.19 60.88,17.73 61.39,18.24 64.69,18.24 64.69,7.06 61.52,3.89 49.2,3.89 48.31,4.78 42.97,4.78 42.47,5.29
POTENT  (via drill 0.35)
  Top 0.254: U$1.18 v34.98,31.07 v34.97,31.07
  Bottom 0.254: v34.97,31.07 37.49,33.58 47.97,33.58 49.32,34.94 49.32,46.82 50.85,48.34 POTENT.1
PWM  (via drill 0.35)
  Top 0.254: U$1.43 v34.98,39.33 v34.97,39.32 | v36.12,26.11 R10.2
  Bottom 0.254: v34.97,39.32 34.97,32 34.31,31.34 34.31,27.92 v36.12,26.11
RST  (via drill 0.35, 0.4)
  Top 0.254: U$1.7 28.7,36.41 v28.5,36.61 | C19.1 10.27,50.24 S2.2 13.38,50.12 v15.92,50.12 18.72,50.12 S2.1 v21.77,50.24 | v39.42,50.12 51.36,50.12 59.36,42.12 J1.10
  Bottom 0.254: v28.5,36.61 15.92,49.18 v15.92,50.12 | v21.77,50.24 39.29,50.24 v39.42,50.12
SWDCLK  (via drill 0.35)
  Top 0.254: U$1.37 37.98,41.95 v38.4,42.37 | v47.04,47.24 47.29,46.99 47.31,46.99 49.48,44.82 49.48,36.02 49.86,35.64 J1.4
  Bottom 0.254: v38.4,42.37 43.27,47.24 v47.04,47.24
SWDIO  (via drill 0.35)
  Top 0.254: U$1.34 38.05,38.41 v38.02,38.43 | v47.04,46.33 47.29,46.08 47.46,46.08 49.07,44.47 49.07,35.77 50.47,34.37 J1.2
  Bottom 0.254: v38.02,38.43 45.92,46.33 v47.04,46.33
VCC  (via drill 0.35)
  Top 0.381: U$1.9 30.95,35.38 30.34,35.38 30.02,35.06 30.02,33.23 29.96,33.17 C21.1 26.78,33.17 C20.1
  Top 0.508: U2.5 23.71,34.37 v24.43,34.37 | v26.08,31.7 26.08,32.47 26.78,33.17
  Bottom 0.508: v24.43,34.37 24.79,34.01 25.34,34.01 26.08,33.27 v26.08,31.7
VCCCAN
  Top 0.508: CON1.P$1 27.54,59.97 27.54,60.45 27.3,60.68 23.87,60.68 23.41,60.22 D1.A 16.94,60.22 CON2.P$1
VIN  (via drill 0.35)
  Top 0.508: U$2.12 26.78,8.27 v26.72,8.21
  Bottom 0.508: v26.72,8.21 26.72,6.05 v25.57,4.91
  pour Top: 2.46,16.97 6.65,16.97 11.22,12.4 13.51,12.4 15.41,10.49 16.18,9.73 16.18,6.43 27.61,6.43 28.5,5.54 28.5,2.62 28.24,2.37 13,2.37 9.57,5.79 8.81,6.56 8.81,12.65 7.41,14.05 3.73,14.05 2.59,14.05 1.7,14.94 1.7,16.21
VOUT  (via drill 0.35)  (2 unrouted)
  Top 0.152: U$2.23 45.26,12.27 | 45.26,12.27 41.2,12.27 | 41.2,12.27 v40.94,12.02 41.2,12.27 | 45.26,12.27 U$2.VCC@1 41.2,12.27
  Top 0.508: U$7.5 5.64,27.13 C17.1
  other vias: 18.97,13.92 20.11,13.92 21.13,13.92 22.15,13.92 22.27,12.65 22.27,11.64 22.4,10.49 23.29,9.61 24.43,9.61 23.42,10.49 24.43,10.49 24.43,11.51 23.42,11.51 35.86,17.23 37.01,17.23 38.15,17.23 39.42,17.23 40.69,17.23 40.69,16.08 39.42,16.08 38.15,16.08 37.01,15.95 35.99,15.95 35.99,14.56 37.26,14.56 38.53,14.56 39.8,14.56 40.94,14.56 40.94,13.29 39.8,13.29 38.66,13.29 37.51,13.29 36.12,13.41 36.12,12.02 37.51,12.02 38.66,12.02 39.8,12.02 40.94,10.88 39.93,10.88 38.66,11 37.51,10.88 36.12,10.75 36.12,9.61 37.51,9.61 38.78,9.61 40.05,9.61 36.12,8.46 37.77,8.46 39.29,8.46 40.81,8.46 40.81,7.32 39.29,7.32 37.89,7.32 36.12,7.32 25.45,11.51 25.45,10.49 18.34,10.24 19.35,10.24 19.35,9.1 20.11,8.34 20.37,9.48 21.13,8.72 22.4,9.35 21.38,9.73
  pour Top: 4.37,27.51 4.37,24.97 4.75,24.59 5.38,23.96 8.43,23.96 11.22,21.16 11.22,14.81 13.26,12.78 15.41,12.78 17.19,11 17.19,10.37 20.62,6.94 35.23,6.94 40.31,12.02 40.31,13.8 40.31,15.45 37.89,17.86 33.15,17.86 29.26,17.86 26.72,15.32 23.54,15.32 23.16,15.7 22.91,15.95 22.91,18.37 21.26,20.02 15.03,20.02 8.05,27 6.65,27 6.02,27.64 4.37,27.64
  pour Bottom (rank 4): 17.45,8.97 27.86,8.97 29.89,6.94 41.45,6.94 41.83,7.32 41.83,17.61 41.58,17.86 31.42,17.86 29,15.45 26.59,15.45 25.7,14.56 17.45,14.56